# EAGLE design Texas (EAGLE 9.5.2)
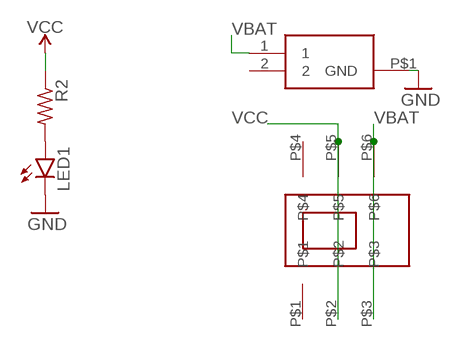
[diagram p0: schematic, sheet 1]

## Parts
LED1  LEDCHIP-LED0805  [CHIP-LED0805]
R2  R-US_R0603  [R0603]
U$1  CL-SB-22A-02T-SLIDE-SWITCH-TUCKED-PADS  [CL-SB-22A-02T-DPDT-COMPACT-SWITCH]
VBAT  BAT-HLD-012-SMT  [BATHLD012SMT]

## Nets
GND: LED1.C VBAT.P$1(GND)
N$1: LED1.A R2.2
VBAT: U$1.P$3 U$1.P$6 VBAT.1
VCC: R2.1 U$1.P$2 U$1.P$5
Unconnected: U$1.P$1 U$1.P$4 VBAT.2

## Library data of the parts
LED1 = led:LED: LED OSRAM: - CHIPLED LG R971, LG N971, LY N971, LG Q971, LY Q971, LO R971, LY R971 LH N974, LH R974 LS Q976, LO Q976, LY Q976 LO Q996 - Hyper CHIPLED LW Q18S LB Q993, LB Q99A, LB R99A - SideLED LS A670, LO A670, LY A670, LG A670, LP A670 LB A673, LV A673, LT A673, LW A673 LH A674 LY A675 LS A676, LA A676, LO A676, LY A676, LW A676 LS A679, LY A679, LG A679 - Hyper Micro SIDELED® LS Y876, LA Y876, LO Y876, LY Y876 LT Y87S - SmartLED LW L88C, LW L88S LB L89C, LB L89S, LG L890 LS L89K, LO L89K, LY L89K LS L896, LA L896, LO L896, LY L896 - TOPLED LS T670, LO T670, LY T670, LG T670, LP T670 LSG T670, LSP T670, LSY T670, LOP T670, LYG T670 LG T671, LOG T671, LSG T671 LB T673, LV T673, LT T673, LW T673 LH T674 LS T676, LA T676, LO T676, LY T676, LB T676, LH T676, LSB T676, LW T676 LB T67C, LV T67C, LT T67C, LS T67K, LO T67K, LY T67K, LW E67C LS E67B, LA E67B, LO E67B, LY E67B, LB E67C, LV E67C, LT E67C LW T67C LS T679, LY T679, LG T679 LS T770, LO T770, LY T770, LG T770, LP T770 LB T773, LV T773, LT T773, LW T773 LH T774 LS E675, LA E675, LY E675, LS T675 LS T776, LA T776, LO T776, LY T776, LB T776 LHGB T686 LT T68C, LB T68C - Hyper Mini TOPLED® LB M676 - Mini TOPLED Santana® LG M470 LS M47K, LO M47K, LY M47K Source: http://www.osram.convergy.de LUXEON: - LUMILED® LXK2-PW12-R00, LXK2-PW12-S00, LXK2-PW14-U00, LXK2-PW14-V00 LXK2-PM12-R00, LXK2-PM12-S00, LXK2-PM14-U00 LXK2-PE12-Q00, LXK2-PE12-R00, LXK2-PE12-S00, LXK2-PE14-T00, LXK2-PE14-U00 LXK2-PB12-K00, LXK2-PB12-L00, LXK2-PB12-M00, LXK2-PB14-N00, LXK2-PB14-P00, LXK2-PB14-Q00 LXK2-PR12-L00, LXK2-PR12-M00, LXK2-PR14-Q00, LXK2-PR14-R00 LXK2-PD12-Q00, LXK2-PD12-R00, LXK2-PD12-S00 LXK2-PH12-R00, LXK2-PH12-S00 LXK2-PL12-P00, LXK2-PL12-Q00, LXK2-PL12-R00 Source: www.luxeon.com KINGBRIGHT: KA-3528ASYC Source: www.kingbright.com
R2 = rcl:R-US_: RESISTOR, American symbol; SPICEPREFIX: R
U$1 = electroninks:CL-SB-22A-02T-SLIDE-SWITCH-TUCKED-PADS
VBAT = SamacSys_Parts:BAT-HLD-012-SMT: Coin Cell Battery Holders Bat Hld CR1216/1225 Surface Mount Source: Datasheet <https://componentsearchengine.com/Datasheets/1/BAT-HLD-012-SMT.pdf>; DESCRIPTION: Coin Cell Battery Holders Bat Hld CR1216/1225 Surface Mount; HEIGHT: 3mm; MANUFACTURER_NAME: Linx Technologies; MANUFACTURER_PART_NUMBER: BAT-HLD-012-SMT; MOUSER_PART_NUMBER: 712-BAT-HLD-012-SMT; MOUSER_PRICE-STOCK: https://www.mouser.com/Search/Refine.aspx?Keyword=712-BAT-HLD-012-SMT

## Board
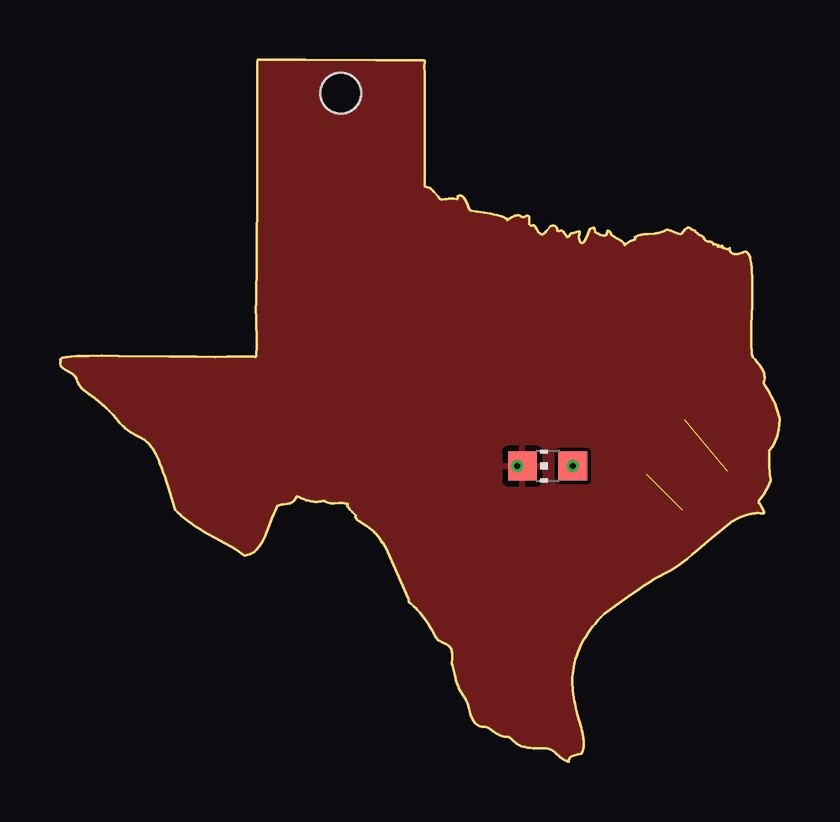
[diagram p1: board, top side]
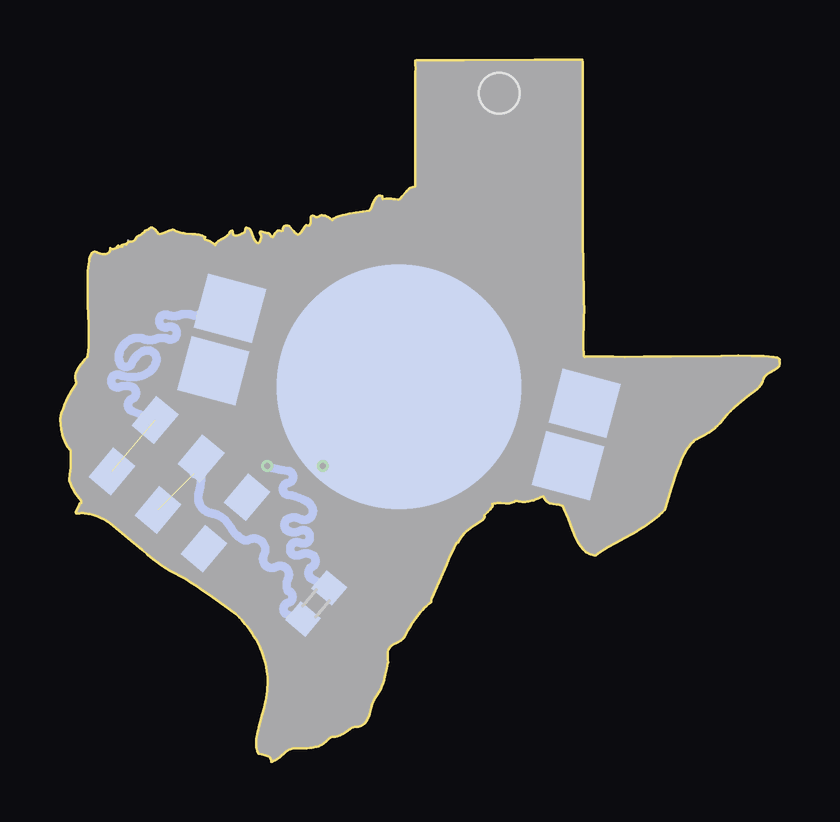
[diagram p2: board, bottom side, seen from below]

Size 30 x 29.26 mm. Coordinates in mm from the lower left corner, seen from the top.
Outline: 10.21,29.26 8.23,29.26 8.23,29.2 8.23,27.72 8.23,25.6 8.22,24.47 8.22,23.13 8.21,21.86 8.19,20.59 8.18,19.53 8.17,19.18 8.16,18.9 8.17,18.47 8.19,17.49 8.19,17.2 8.18,17.06 8.18,16.99 8.17,16.92 8.14,16.87 8.08,16.91 7.59,16.9 6.96,16.89 6.46,16.89 5.68,16.89 4.56,16.9 2.44,16.93 1.73,16.93 1.17,16.93 0.89,16.92 0.68,16.91 0.46,16.9 0.32,16.89 0.25,16.88 0.18,16.86 0.12,16.85 0.05,16.82 0,16.78 0.02,16.71 0,16.65 0,16.58 0.03,16.51 0.07,16.46 0.12,16.41 0.18,16.37 0.24,16.34 0.43,16.23 0.48,16.2 0.54,16.16 0.6,16.11 0.64,16.06 0.68,16 0.7,15.93 0.72,15.87 0.75,15.8 0.79,15.74 0.83,15.68 0.87,15.63 0.92,15.58 0.97,15.53 1.02,15.48 1.07,15.43 1.19,15.35 1.47,15.14 1.64,15.01 1.75,14.92 1.9,14.78 1.96,14.73 2.06,14.63 2.2,14.48 2.34,14.32 2.47,14.15 2.52,14.1 2.62,14 2.67,13.95 2.72,13.91 2.83,13.82 2.95,13.74 3.01,13.7 3.13,13.63 3.38,13.5 3.44,13.47 3.5,13.43 3.56,13.39 3.62,13.35 3.67,13.3 3.72,13.25 3.76,13.19 3.81,13.14 3.85,13.08 3.92,12.96 3.95,12.9 3.99,12.84 4.05,12.71 4.11,12.58 4.16,12.45 4.24,12.25 4.31,12.06 4.36,11.92 4.45,11.65 4.51,11.45 4.6,11.18 4.7,10.85 4.77,10.57 4.81,10.51 4.9,10.41 5,10.31 5.06,10.26 5.11,10.22 5.22,10.13 5.33,10.04 5.44,9.96 5.56,9.88 5.67,9.8 5.85,9.69 5.98,9.61 6.16,9.51 6.47,9.34 6.84,9.14 7.15,8.96 7.33,8.85 7.45,8.78 7.56,8.7 7.67,8.61 7.74,8.61 7.81,8.62 7.88,8.64 7.94,8.67 8.01,8.7 8.06,8.74 8.12,8.78 8.17,8.83 8.22,8.88 8.27,8.94 8.31,8.99 8.35,9.05 8.39,9.11 8.42,9.17 8.49,9.3 8.55,9.42 8.6,9.55 8.65,9.68 8.83,10.15 8.91,10.34 8.96,10.47 9.05,10.67 9.11,10.7 9.18,10.72 9.25,10.73 9.32,10.74 9.46,10.76 9.53,10.77 9.59,10.78 9.66,10.81 9.71,10.85 9.76,10.9 9.81,10.96 9.87,11.07 9.94,11.05 10.06,10.99 10.13,10.96 10.19,10.93 10.26,10.91 10.33,10.89 10.4,10.87 10.47,10.86 10.53,10.85 10.61,10.84 10.68,10.84 10.75,10.84 10.82,10.85 10.89,10.86 10.96,10.87 11.02,10.87 11.08,10.84 11.14,10.81 11.21,10.79 11.28,10.78 11.35,10.78 11.42,10.78 11.63,10.79 11.7,10.79 11.77,10.79 11.84,10.79 11.91,10.77 11.98,10.76 11.97,10.7 12,10.64 12.04,10.58 12.08,10.53 12.17,10.42 12.32,10.27 12.31,10.21 12.34,10.14 12.39,10.1 12.44,10.05 12.74,9.86 12.85,9.78 12.91,9.74 12.97,9.7 13.07,9.6 13.12,9.55 13.17,9.5 13.22,9.45 13.26,9.39 13.3,9.34 13.34,9.28 13.38,9.22 13.41,9.15 13.46,9.12 13.5,9.06 13.57,8.94 13.66,8.75 13.75,8.56 13.89,8.24 14.52,6.82 14.53,6.75 14.54,6.68 14.58,6.62 14.63,6.58 14.74,6.49 14.79,6.44 14.84,6.39 14.89,6.34 14.99,6.24 15.08,6.13 15.12,6.07 15.2,5.96 15.24,5.9 15.36,5.72 15.39,5.66 15.5,5.48 15.57,5.36 15.64,5.23 15.67,5.17 15.72,5.12 15.77,5.08 15.83,5.04 15.89,5 16.02,4.95 16.08,4.91 16.14,4.88 16.2,4.84 16.25,4.79 16.28,4.73 16.31,4.66 16.33,4.6 16.34,4.53 16.35,4.46 16.35,4.39 16.34,4.32 16.33,4.25 16.32,4.18 16.33,4.11 16.35,4.04 16.37,3.97 16.39,3.91 16.45,3.63 16.48,3.49 16.5,3.43 16.54,3.29 16.59,3.16 16.64,3.03 16.68,2.97 16.71,2.91 16.78,2.79 16.91,2.62 16.94,2.55 16.98,2.42 17.02,2.28 17.1,2.01 17.14,1.88 17.17,1.81 17.2,1.75 17.24,1.69 17.28,1.64 17.33,1.59 17.39,1.54 17.45,1.51 17.51,1.48 17.58,1.46 17.65,1.46 17.72,1.46 17.78,1.44 17.85,1.41 17.91,1.37 18.08,1.25 18.2,1.18 18.26,1.14 18.32,1.11 18.39,1.09 18.45,1.06 18.52,1.05 18.59,1.04 18.66,1.04 18.73,1.03 18.83,0.94 18.88,0.89 18.93,0.84 18.98,0.8 19.04,0.76 19.1,0.72 19.16,0.69 19.23,0.66 19.29,0.64 19.36,0.62 19.43,0.6 19.5,0.59 19.57,0.58 19.71,0.57 19.85,0.57 19.99,0.57 20.2,0.57 20.27,0.57 20.34,0.55 20.41,0.53 20.47,0.5 20.53,0.46 20.59,0.42 20.64,0.37 20.8,0.23 20.85,0.19 20.91,0.14 20.96,0.1 21.02,0.07 21.09,0.04 21.15,0.01 21.2,0 21.2,0.07 21.22,0.14 21.26,0.19 21.32,0.23 21.38,0.26 21.45,0.28 21.58,0.31 21.72,0.35 21.75,0.41 21.78,0.47 21.8,0.54 21.81,0.61 21.82,0.68 21.82,0.75 21.82,0.82 21.82,0.89 21.81,0.96 21.8,1.03 21.78,1.17 21.75,1.31 21.71,1.44 21.56,1.99 21.49,2.26 21.46,2.4 21.43,2.54 21.41,2.68 21.39,2.81 21.37,2.95 21.36,3.1 21.35,3.24 21.35,3.38 21.35,3.52 21.36,3.66 21.38,3.8 21.4,3.94 21.43,4.08 21.44,4.15 21.48,4.28 21.52,4.42 21.54,4.48 21.59,4.62 21.65,4.75 21.68,4.81 21.74,4.94 21.81,5.06 21.85,5.12 21.92,5.24 22,5.36 22.08,5.47 22.21,5.64 22.29,5.75 22.43,5.91 22.53,6.02 22.68,6.17 23.13,6.5 23.65,6.87 24.11,7.19 24.34,7.35 24.52,7.47 24.76,7.62 24.88,7.69 25,7.76 25.19,7.86 25.44,7.99 25.5,8.02 25.57,8.06 25.68,8.13 25.8,8.21 25.91,8.3 26.13,8.47 26.35,8.65 26.57,8.83 27.17,9.33 27.92,9.97 27.98,10.01 28.1,10.07 28.16,10.11 28.29,10.17 28.42,10.22 28.55,10.27 28.62,10.29 28.76,10.33 28.83,10.34 28.89,10.36 28.96,10.36 29.04,10.37 29.11,10.37 29.18,10.37 29.32,10.35 29.35,10.39 29.32,10.46 29.22,10.64 29.17,10.77 29.11,10.81 29.12,10.87 29.16,10.93 29.19,10.99 29.36,11.22 29.39,11.28 29.43,11.34 29.47,11.4 29.5,11.46 29.53,11.52 29.55,11.59 29.57,11.66 29.61,11.71 29.61,11.78 29.58,11.99 29.57,12.13 29.56,12.27 29.55,12.41 29.55,12.55 29.55,12.69 29.55,12.83 29.55,12.97 29.59,13.03 29.64,13.08 29.68,13.14 29.71,13.2 29.75,13.26 29.78,13.32 29.81,13.39 29.86,13.52 29.9,13.65 29.93,13.79 29.95,13.86 29.96,13.93 29.96,14 29.97,14.07 29.96,14.14 29.98,14.18 30,14.24 29.99,14.31 29.97,14.38 29.96,14.45 29.92,14.59 29.87,14.72 29.84,14.78 29.79,14.92 29.74,15.04 29.64,15.24 29.58,15.36 29.54,15.42 29.47,15.54 29.43,15.6 29.31,15.77 29.33,15.84 29.35,15.91 29.36,15.97 29.36,16.05 29.35,16.11 29.34,16.18 29.32,16.25 29.29,16.32 29.26,16.38 29.22,16.44 29.18,16.5 29.14,16.56 29.1,16.61 29.01,16.72 28.97,16.77 28.87,16.88 28.85,16.94 28.83,17.01 28.82,17.08 28.82,17.15 28.81,17.29 28.8,17.36 28.8,17.5 28.8,17.72 28.8,18 28.81,18.21 28.84,19.06 28.84,19.41 28.85,19.62 28.85,19.83 28.85,20.04 28.84,20.19 28.83,20.47 28.82,20.61 28.81,20.75 28.78,20.89 28.77,20.96 28.75,21.02 28.73,21.09 28.7,21.16 28.67,21.22 28.61,21.26 28.55,21.28 28.48,21.26 28.44,21.23 28.38,21.2 28.31,21.19 28.24,21.18 28.17,21.17 28.1,21.18 28.03,21.19 27.97,21.22 27.93,21.28 27.91,21.34 27.9,21.41 27.84,21.39 27.78,21.37 27.71,21.4 27.65,21.42 27.59,21.44 27.62,21.47 27.62,21.48 27.58,21.52 27.55,21.49 27.48,21.48 27.41,21.49 27.44,21.52 27.42,21.54 27.35,21.56 27.29,21.59 27.26,21.59 27.24,21.58 27.19,21.62 27.15,21.67 27.09,21.69 27.02,21.7 26.95,21.71 26.89,21.75 26.85,21.8 26.82,21.86 26.78,21.91 26.72,21.93 26.66,21.96 26.6,22 26.54,22.04 26.49,22.09 26.45,22.14 26.39,22.16 26.33,22.19 26.28,22.24 26.22,22.27 26.15,22.27 26.09,22.23 26.04,22.19 25.99,22.14 25.95,22.08 25.9,22.03 25.83,22.01 25.76,22.02 25.7,22.04 25.63,22.06 25.44,22.15 25.37,22.17 25.3,22.18 25.24,22.17 25.18,22.13 25.12,22.1 25.05,22.08 24.98,22.06 24.91,22.05 24.84,22.04 24.77,22.03 24.49,22.01 24.42,22.01 24.35,22 24.28,21.99 24.21,21.97 24.15,21.96 24.08,21.94 24.01,21.91 23.95,21.88 23.98,21.84 23.95,21.78 23.89,21.76 23.76,21.7 23.69,21.67 23.63,21.64 23.58,21.59 23.53,21.54 23.51,21.6 23.47,21.66 23.41,21.7 23.36,21.74 23.29,21.78 23.17,21.84 23.11,21.88 23.05,21.92 23,21.96 22.96,22.02 22.92,22.08 22.88,22.13 22.82,22.16 22.8,22.09 22.79,22.03 22.76,21.96 22.7,21.94 22.63,21.95 22.56,21.96 22.49,21.99 22.43,22.02 22.36,22.05 22.31,22.09 22.28,22.22 22.24,22.27 22.18,22.26 22.12,22.22 22.08,22.21 22.05,22.15 21.94,21.89 21.92,21.82 21.88,21.76 21.85,21.7 21.8,21.65 21.74,21.62 21.68,21.66 21.65,21.72 21.63,21.79 21.61,21.86 21.62,21.92 21.64,21.99 21.67,22.05 21.65,22.12 21.58,22.11 21.45,22.07 21.38,22.05 21.31,22.05 21.27,22.02 21.24,21.96 21.2,21.91 21.14,21.89 21.09,21.94 21.02,22.06 20.97,22.11 20.92,22.14 20.85,22.15 20.78,22.13 20.73,22.14 20.71,22.21 20.69,22.27 20.65,22.33 20.58,22.36 20.51,22.36 20.45,22.33 20.26,22.12 20.22,22.07 20.16,22.03 20.1,21.99 20.03,22 19.98,22.04 19.94,22.1 19.86,22.21 19.78,22.33 19.74,22.38 19.68,22.36 19.61,22.37 19.56,22.42 19.55,22.48 19.54,22.55 19.54,22.69 19.53,22.76 19.47,22.78 19.41,22.75 19.35,22.72 19.28,22.71 19.22,22.73 19.16,22.77 19.09,22.79 19.02,22.78 18.95,22.77 18.89,22.74 18.83,22.71 18.76,22.67 18.65,22.6 18.61,22.64 18.56,22.68 18.49,22.71 18.43,22.73 18.36,22.75 18.22,22.79 18.09,22.82 17.95,22.85 17.67,22.9 17.39,22.94 17.11,22.97 17.07,23.01 17.04,23.08 16.96,23.27 16.93,23.34 16.9,23.4 16.87,23.46 16.83,23.52 16.78,23.57 16.71,23.6 16.64,23.6 16.58,23.58 16.58,23.51 16.54,23.47 16.4,23.48 16.33,23.48 16.26,23.48 16.19,23.48 16.12,23.47 16.05,23.46 15.91,23.44 15.85,23.46 15.8,23.51 15.75,23.56 15.57,23.77 15.52,23.82 15.47,23.87 15.42,23.92 15.36,23.95 15.29,23.97 15.22,23.97 15.19,24.01 15.19,28.73 15.18,28.94 15.19,29.02 15.19,29.16 15.19,29.22 15.15,29.26 15.08,29.26 15.01,29.26 13.17,29.26 10.21,29.26
Copper layers (1*16): Top 0.035559375mm / dielectric 1.6mm / Bottom 0.035559375mm
Design rules "oshpark-2layer *": minimum track width 6mil, minimum drill 10mil, track to track 6mil, track to pad 6mil, pad to pad 6mil, via to via 6mil, smd to smd 6mil, copper to edge 0mil, drill to drill 6mil, minimum pad ring 5mil, minimum via ring 5mil, stop-mask expansion 2.5mil, vias tented up to drill 10mil, thermal gap 10mil
Holes 1.7 mm at 11.7,27.88

### Footprints (pad centres in the part's own frame; a part is rotated, then mirrored left to right if it is on the bottom)
CHIP-LED0805 = smd 1.2 x 1.2: A 0,-1.05; C 0,1.05
R0603 = smd 1 x 1.1: 1 -0.85,0; 2 0.85,0
CL-SB-22A-02T-DPDT-COMPACT-SWITCH = smd 1.2 x 1.6: P$1 -2.5,-1.4; P$2 0,-1.4; P$3 2.5,-1.4; P$4 -2.5,1.4; P$5 0,1.4; P$6 2.5,1.4
BATHLD012SMT = smd 2.5 x 2.325: 1 -7.65,1.35; 2 7.65,1.35; P$2 -7.65,-1.35; P$3 7.65,-1.35 | smd 10.2 x 10.2: P$1 0,0

### Placement (x,y rotation side)
LED1  20.32,12.33 90 top
R2  19.33,6.6 50 bottom
U$1  25.02,11.57 140 bottom
VBAT  15.87,15.63 345 bottom

### Tracks (layer width: path | path; a pad name or v marks a point on that pad's centre or on a via)
GND  (via drill 0.25)
  Bottom 0.35: VBAT.P$1 17.02,14.36 v19.05,12.33
  pour Top (rank 3): 10.21,29.26 8.23,29.26 8.23,29.2 8.23,27.72 8.23,25.6 8.22,24.47 8.22,23.13 8.21,21.86 8.19,20.59 8.18,19.53 8.17,19.18 8.16,18.9 8.17,18.47 8.19,17.48 8.19,17.2 8.18,17.06 8.18,16.99 8.17,16.92 8.14,16.87 8.08,16.91 7.59,16.9 6.96,16.89 6.46,16.89 5.68,16.89 4.56,16.9 2.44,16.93 1.73,16.93 1.17,16.93 0.89,16.92 0.68,16.91 0.46,16.9 0.32,16.89 0.25,16.88 0.18,16.86 0.12,16.85 0.05,16.82 0,16.78 0.02,16.71 0,16.65 0,16.58 0.03,16.51 0.07,16.46 0.12,16.41 0.18,16.37 0.24,16.34 0.43,16.23 0.48,16.2 0.54,16.16 0.6,16.11 0.64,16.06 0.68,16 0.7,15.93 0.72,15.87 0.75,15.8 0.79,15.74 0.83,15.68 0.87,15.63 0.92,15.57 0.97,15.53 1.02,15.48 1.07,15.43 1.19,15.35 1.47,15.14 1.64,15.01 1.75,14.92 1.9,14.78 1.96,14.73 2.06,14.63 2.2,14.48 2.34,14.32 2.47,14.15 2.52,14.1 2.62,14 2.67,13.95 2.72,13.91 2.83,13.82 2.95,13.74 3.01,13.7 3.13,13.63 3.38,13.5 3.44,13.47 3.5,13.43 3.56,13.39 3.62,13.35 3.67,13.3 3.72,13.25 3.76,13.19 3.81,13.14 3.85,13.08 3.92,12.96 3.95,12.9 3.99,12.84 4.05,12.71 4.11,12.58 4.16,12.45 4.24,12.25 4.31,12.06 4.36,11.92 4.45,11.65 4.51,11.45 4.6,11.18 4.7,10.85 4.77,10.57 4.81,10.51 4.9,10.41 5,10.31 5.06,10.26 5.11,10.22 5.22,10.13 5.33,10.04 5.44,9.96 5.56,9.88 5.67,9.8 5.85,9.69 5.98,9.61 6.16,9.51 6.47,9.34 6.84,9.14 7.15,8.96 7.33,8.85 7.45,8.78 7.56,8.7 7.67,8.61 7.74,8.61 7.81,8.62 7.88,8.64 7.94,8.67 8.01,8.7 8.06,8.74 8.12,8.78 8.17,8.83 8.22,8.88 8.27,8.94 8.31,8.99 8.35,9.05 8.39,9.11 8.42,9.17 8.49,9.3 8.55,9.42 8.6,9.55 8.65,9.68 8.83,10.15 8.91,10.34 8.96,10.47 9.05,10.67 9.11,10.7 9.18,10.72 9.25,10.73 9.32,10.74 9.46,10.76 9.53,10.77 9.59,10.78 9.66,10.81 9.71,10.85 9.76,10.9 9.81,10.96 9.87,11.07 9.94,11.05 10.06,10.99 10.13,10.96 10.19,10.93 10.26,10.91 10.33,10.89 10.4,10.87 10.47,10.86 10.53,10.85 10.61,10.84 10.68,10.84 10.75,10.84 10.82,10.85 10.89,10.86 10.96,10.87 11.02,10.87 11.08,10.84 11.14,10.81 11.21,10.79 11.28,10.78 11.35,10.78 11.42,10.78 11.63,10.79 11.7,10.79 11.77,10.79 11.84,10.78 11.91,10.77 11.98,10.76 11.97,10.7 12,10.64 12.04,10.58 12.08,10.53 12.17,10.42 12.32,10.27 12.31,10.21 12.34,10.14 12.39,10.1 12.44,10.05 12.74,9.86 12.85,9.78 12.91,9.74 12.97,9.69 13.07,9.6 13.12,9.55 13.17,9.5 13.22,9.45 13.26,9.39 13.3,9.34 13.34,9.28 13.38,9.22 13.41,9.15 13.46,9.12 13.5,9.06 13.57,8.94 13.66,8.75 13.75,8.56 13.89,8.24 14.52,6.81 14.53,6.75 14.54,6.68 14.58,6.62 14.63,6.58 14.74,6.49 14.79,6.44 14.84,6.39 14.89,6.34 14.99,6.24 15.08,6.13 15.12,6.07 15.2,5.96 15.24,5.9 15.36,5.72 15.39,5.66 15.5,5.48 15.57,5.36 15.64,5.23 15.67,5.17 15.72,5.12 15.77,5.08 15.83,5.04 15.89,5 16.02,4.95 16.08,4.91 16.14,4.88 16.2,4.84 16.25,4.79 16.28,4.73 16.31,4.66 16.33,4.6 16.34,4.53 16.35,4.46 16.35,4.39 16.34,4.32 16.33,4.25 16.32,4.18 16.33,4.11 16.35,4.04 16.37,3.97 16.39,3.91 16.45,3.63 16.48,3.49 16.5,3.43 16.54,3.29 16.59,3.16 16.64,3.03 16.68,2.97 16.71,2.91 16.78,2.79 16.91,2.62 16.94,2.55 16.98,2.42 17.02,2.28 17.1,2.01 17.14,1.88 17.17,1.81 17.2,1.75 17.24,1.69 17.28,1.64 17.33,1.59 17.39,1.54 17.45,1.51 17.51,1.48 17.58,1.46 17.65,1.46 17.72,1.46 17.78,1.44 17.85,1.41 17.91,1.37 18.08,1.25 18.2,1.18 18.26,1.14 18.32,1.11 18.39,1.09 18.45,1.06 18.52,1.05 18.59,1.04 18.66,1.04 18.73,1.03 18.83,0.93 18.88,0.89 18.93,0.84 18.98,0.8 19.04,0.75 19.1,0.72 19.16,0.69 19.23,0.66 19.29,0.64 19.36,0.62 19.43,0.6 19.5,0.59 19.57,0.58 19.71,0.57 19.85,0.57 19.99,0.57 20.2,0.57 20.27,0.57 20.34,0.55 20.41,0.53 20.47,0.5 20.53,0.46 20.59,0.42 20.64,0.37 20.8,0.23 20.85,0.19 20.91,0.14 20.96,0.1 21.02,0.07 21.09,0.04 21.15,0.01 21.2,0 21.2,0.07 21.22,0.14 21.26,0.19 21.32,0.23 21.38,0.26 21.45,0.28 21.58,0.31 21.72,0.35 21.75,0.41 21.78,0.47 21.8,0.54 21.81,0.61 21.82,0.68 21.82,0.75 21.82,0.82 21.82,0.89 21.81,0.96 21.8,1.03 21.78,1.17 21.75,1.31 21.71,1.44 21.56,1.99 21.49,2.26 21.46,2.4 21.43,2.54 21.41,2.67 21.39,2.81 21.37,2.95 21.36,3.1 21.35,3.24 21.35,3.38 21.35,3.52 21.36,3.66 21.38,3.8 21.4,3.94 21.43,4.08 21.44,4.15 21.48,4.28 21.52,4.42 21.54,4.48 21.59,4.62 21.65,4.75 21.68,4.81 21.74,4.94 21.81,5.06 21.85,5.12 21.92,5.24 22,5.36 22.08,5.47 22.21,5.64 22.29,5.75 22.43,5.91 22.53,6.02 22.68,6.17 23.13,6.5 23.65,6.87 24.11,7.19 24.34,7.35 24.52,7.47 24.76,7.62 24.88,7.69 25,7.76 25.19,7.86 25.44,7.99 25.5,8.02 25.57,8.06 25.68,8.13 25.8,8.21 25.91,8.3 26.13,8.47 26.35,8.65 26.57,8.83 27.17,9.33 27.92,9.97 27.98,10.01 28.1,10.07 28.16,10.11 28.29,10.17 28.42,10.22 28.55,10.27 28.62,10.29 28.76,10.33 28.83,10.34 28.89,10.36 28.96,10.36 29.04,10.37 29.11,10.37 29.18,10.37 29.32,10.35 29.35,10.39 29.32,10.46 29.22,10.64 29.17,10.77 29.11,10.81 29.12,10.87 29.16,10.93 29.19,10.99 29.36,11.22 29.39,11.28 29.43,11.34 29.47,11.4 29.5,11.46 29.53,11.52 29.55,11.59 29.57,11.66 29.61,11.71 29.61,11.78 29.58,11.99 29.57,12.13 29.56,12.27 29.55,12.41 29.55,12.55 29.55,12.69 29.55,12.83 29.55,12.97 29.59,13.03 29.64,13.08 29.68,13.14 29.71,13.2 29.75,13.26 29.78,13.32 29.81,13.39 29.86,13.52 29.9,13.65 29.93,13.79 29.95,13.86 29.96,13.93 29.96,14 29.97,14.07 29.96,14.14 29.98,14.18 30,14.24 29.99,14.31 29.97,14.38 29.96,14.45 29.92,14.59 29.87,14.72 29.84,14.78 29.79,14.92 29.74,15.04 29.64,15.24 29.58,15.36 29.54,15.42 29.47,15.54 29.43,15.6 29.31,15.77 29.33,15.84 29.35,15.91 29.36,15.97 29.36,16.04 29.35,16.11 29.34,16.18 29.32,16.25 29.29,16.32 29.26,16.38 29.22,16.44 29.18,16.5 29.14,16.56 29.1,16.61 29.01,16.72 28.97,16.77 28.87,16.88 28.85,16.94 28.83,17.01 28.82,17.08 28.82,17.15 28.81,17.29 28.8,17.36 28.8,17.5 28.8,17.72 28.8,18 28.81,18.21 28.84,19.06 28.84,19.41 28.85,19.62 28.85,19.83 28.85,20.04 28.84,20.19 28.83,20.47 28.82,20.61 28.81,20.75 28.78,20.89 28.77,20.96 28.75,21.02 28.73,21.09 28.7,21.16 28.67,21.22 28.61,21.26 28.55,21.28 28.48,21.26 28.44,21.23 28.38,21.2 28.31,21.19 28.24,21.18 28.17,21.17 28.1,21.17 28.03,21.19 27.97,21.22 27.93,21.28 27.9,21.34 27.9,21.41 27.84,21.39 27.78,21.37 27.71,21.4 27.65,21.42 27.59,21.44 27.62,21.47 27.62,21.48 27.58,21.52 27.55,21.49 27.48,21.48 27.41,21.49 27.44,21.52 27.42,21.54 27.35,21.56 27.29,21.59 27.26,21.59 27.24,21.58 27.19,21.62 27.09,21.69 27.02,21.7 26.95,21.71 26.89,21.75 26.85,21.8 26.82,21.86 26.78,21.91 26.72,21.93 26.66,21.96 26.6,22 26.54,22.04 26.49,22.09 26.45,22.14 26.39,22.16 26.33,22.19 26.28,22.24 26.22,22.27 26.15,22.27 26.09,22.23 26.04,22.19 25.99,22.14 25.95,22.08 25.9,22.03 25.83,22.01 25.76,22.02 25.7,22.04 25.63,22.06 25.44,22.15 25.37,22.17 25.3,22.18 25.24,22.17 25.18,22.13 25.12,22.1 25.05,22.08 24.98,22.06 24.91,22.05 24.84,22.04 24.77,22.03 24.49,22.01 24.42,22.01 24.35,22 24.28,21.99 24.21,21.97 24.15,21.96 24.08,21.93 24.01,21.91 23.95,21.88 23.98,21.84 23.95,21.78 23.89,21.76 23.76,21.7 23.69,21.67 23.63,21.64 23.58,21.59 23.53,21.54 23.51,21.6 23.47,21.66 23.41,21.7 23.36,21.74 23.29,21.78 23.17,21.84 23.11,21.88 23.05,21.92 23,21.96 22.96,22.02 22.92,22.08 22.88,22.13 22.82,22.16 22.8,22.09 22.79,22.03 22.76,21.96 22.7,21.94 22.63,21.95 22.56,21.96 22.49,21.99 22.43,22.02 22.36,22.05 22.31,22.09 22.28,22.22 22.24,22.27 22.18,22.26 22.12,22.22 22.08,22.21 22.05,22.15 21.94,21.89 21.92,21.82 21.88,21.76 21.85,21.7 21.8,21.65 21.74,21.62 21.68,21.66 21.65,21.72 21.63,21.79 21.61,21.86 21.62,21.92 21.64,21.99 21.67,22.05 21.65,22.12 21.58,22.11 21.45,22.07 21.38,22.05 21.31,22.05 21.27,22.02 21.24,21.96 21.2,21.91 21.14,21.89 21.09,21.94 21.02,22.06 20.97,22.11 20.92,22.14 20.85,22.15 20.78,22.13 20.73,22.14 20.71,22.21 20.69,22.27 20.65,22.33 20.58,22.36 20.51,22.36 20.45,22.33 20.26,22.12 20.22,22.07 20.16,22.03 20.1,21.99 20.03,22 19.98,22.04 19.94,22.1 19.86,22.21 19.78,22.33 19.74,22.38 19.68,22.36 19.61,22.37 19.56,22.42 19.55,22.48 19.54,22.55 19.54,22.69 19.53,22.76 19.47,22.78 19.41,22.75 19.35,22.72 19.28,22.71 19.22,22.73 19.16,22.77 19.09,22.79 19.02,22.78 18.95,22.77 18.89,22.74 18.83,22.71 18.76,22.67 18.65,22.6 18.61,22.64 18.56,22.68 18.49,22.71 18.43,22.73 18.36,22.75 18.22,22.79 18.09,22.82 17.95,22.85 17.67,22.9 17.39,22.94 17.11,22.97 17.07,23.01 17.04,23.08 16.96,23.27 16.93,23.34 16.9,23.4 16.87,23.46 16.83,23.52 16.78,23.57 16.71,23.6 16.64,23.6 16.58,23.58 16.58,23.51 16.54,23.47 16.4,23.48 16.33,23.48 16.26,23.48 16.19,23.48 16.12,23.47 16.05,23.46 15.91,23.44 15.85,23.46 15.8,23.51 15.75,23.56 15.57,23.77 15.52,23.82 15.47,23.87 15.42,23.92 15.36,23.95 15.29,23.97 15.22,23.97 15.19,24.01 15.19,28.73 15.18,28.94 15.19,29.02 15.19,29.15 15.19,29.22 15.15,29.26 15.08,29.26 15.01,29.26 13.17,29.26 10.21,29.26
N$1  (via drill 0.25)
  Bottom 0.35: LED1.A 21.37,12.27 arc0 20.5,12.13 arc162 20.5,11.63 arc-162 20.5,11.13 arc19 19.75,10.88 arc34 19.5,10.63 arc146 20,10.13 arc-56 20.5,10.13 arc-124 20.5,9.63 arc-56 20,9.63 arc236 20,9.13 arc-236 20,8.63 arc56 19.5,8.63 arc124 19.5,8.13 arc-124 19.5,7.63 R2.2
  other vias: 21.37,12.33
VBAT  (1 unrouted)
  Bottom 0.35: VBAT.1 24,18.92 arc103 24.5,18.63 arc-43 25,18.63 arc43 25.5,18.63 arc-223 25.5,18.13 arc223 25.5,17.63 arc-43 26,17.63 arc43 26.5,17.63 arc-43 27,17.63 arc-47 27.5,17.13 arc-43 27.5,16.63 arc-137 27,16.63 arc47 26.5,17.13 arc133 26,16.63 arc47 26.5,16.13 arc43 27.5,16.13 arc-223 27.5,15.63 arc43 27,15.63 arc137 27,15.13 arc-137 27,14.63 U$1.P$3
VCC  (1 unrouted)
  Bottom 0.35: 20.13,6.2 R2.1 20.5,6.13 arc148 20.5,6.63 arc-148 20.5,7.13 arc56 20.5,7.63 arc-146 21,8.13 arc146 21.5,8.63 arc-146 22.13,9.26 arc56 22.37,9.26 arc34 22.87,9.76 arc-34 23.37,10.26 arc-19 23.66,10.35 arc94 24.22,11.19 arc-19 U$1.P$2 arc-45 24.42,12